# EAGLE schematic finacbv1 (EAGLE 9.1.0)
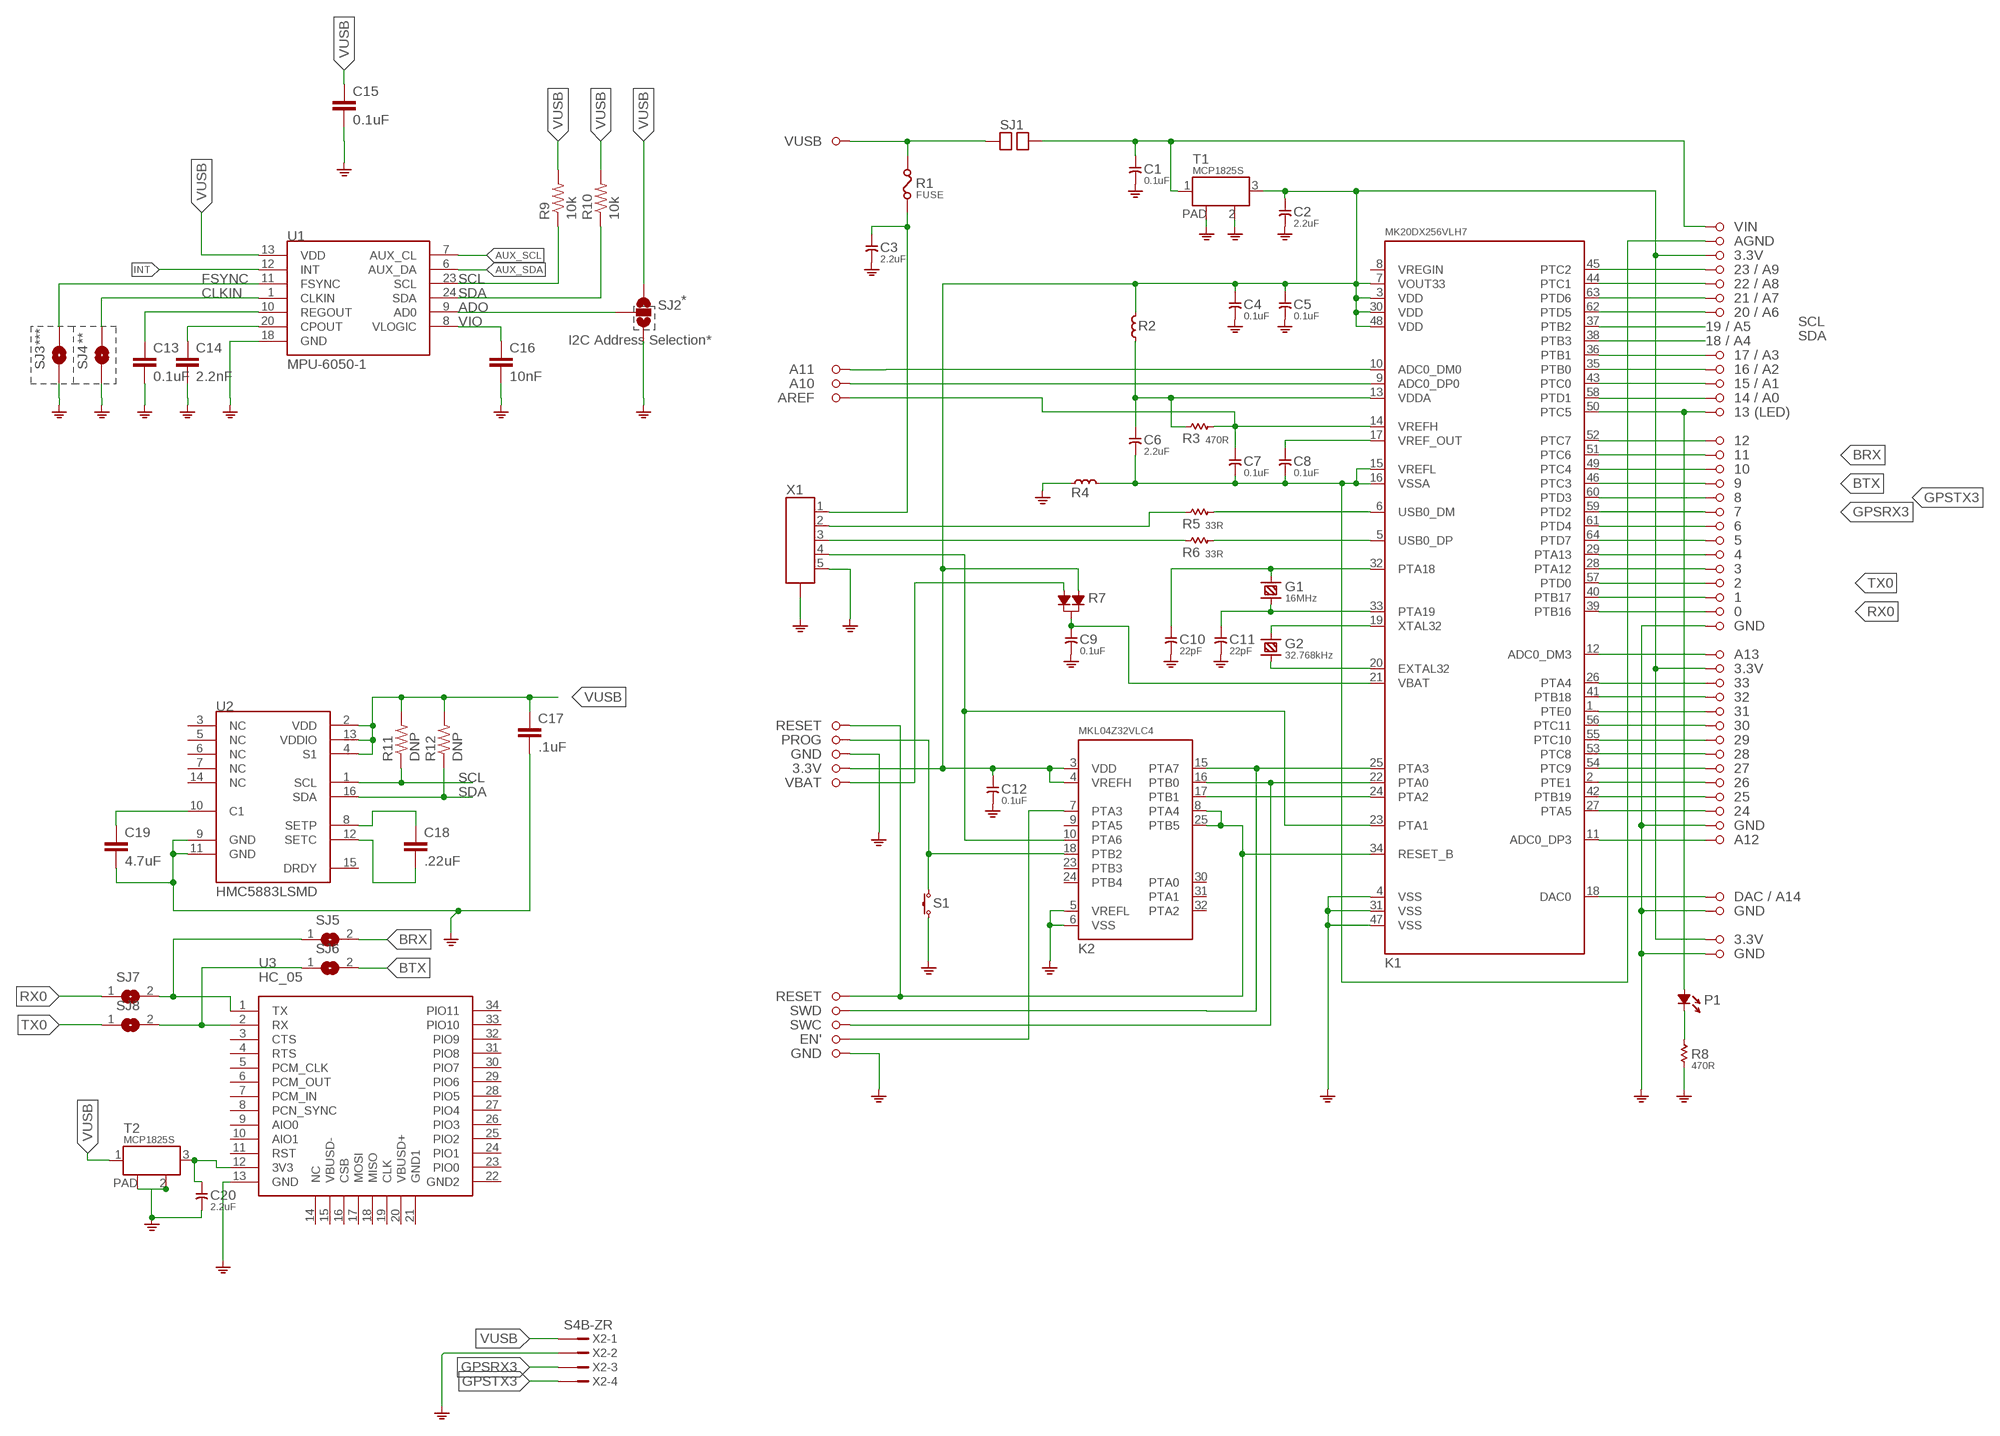
[diagram p0: schematic, sheet 1]

## Parts
C1  0.1uF  CAPACITOR-0.1UF  [C0603]
C2  2.2uF  CAPACITOR-2.2UF  [C0805]
C3  2.2uF  CAPACITOR-2.2UF  [C0805]
C4  0.1uF  CAPACITOR-0.1UF  [C0603]
C5  0.1uF  CAPACITOR-0.1UF  [C0603]
C6  2.2uF  CAPACITOR-2.2UF  [C0805]
C7  0.1uF  CAPACITOR-0.1UF  [C0603]
C8  0.1uF  CAPACITOR-0.1UF  [C0603]
C9  0.1uF  CAPACITOR-0.1UF  [C0603]
C10  22pF  CAPACITOR-22PF  [C0603]
C11  22pF  CAPACITOR-22PF  [C0603]
C12  0.1uF  CAPACITOR-0.1UF  [C0603]
C13  0.1uF  CAP0603-CAP  [0603-CAP]
C14  2.2nF  CAP0603-CAP  [0603-CAP]
C15  0.1uF  CAP0603-CAP  [0603-CAP]
C16  10nF  CAP0603-CAP  [0603-CAP]
C17  .1uF  CAP0402-CAP  [0402-CAP]
C18  .22uF  CAP0402-CAP  [0402-CAP]
C19  4.7uF  CAP0402-CAP  [0402-CAP]
C20  2.2uF  CAPACITOR-2.2UF  [C0805]
G1  16MHz  CRYSTAL-HC49US  [HC49US]
G2  32.768kHz  CRYSTAL-TC26H  [TC26H]
K1  MK20DX256VLH7  [LQFP64-05]
K2  MKL04Z32VLC4  [LQFP32-08]
P1  LED  [LED-0805]
R1  FUSE  [F0805]
R2  FERRITE  [L0603]
R3  470R  RESISTOR-470R  [R0603]
R4  FERRITE  [L0603]
R5  33R  RESISTOR-33R  [R0603]
R6  33R  RESISTOR-33R  [R0603]
R7  DIODE_DUAL  [SOT-23]
R8  470R  RESISTOR-470R  [R0603]
R9  10k  RESISTOR0603-RES  [0603-RES]
R10  10k  RESISTOR0603-RES  [0603-RES]
R11  DNP  RESISTOR0402-RES  [0402-RES]
R12  DNP  RESISTOR0402-RES  [0402-RES]
S1  TACT_SWITCH  [ALPS_SKHH]
SJ1  SOLDERJUMPER  [SOLDERJUMPER]
SJ2  SOLDERJUMPER_2WAYPASTE2&3  [SJ_3_PASTE2&3]
SJ3  SOLDERJUMPERTRACE  [SJ_2S-TRACE]
SJ4  SOLDERJUMPERTRACE  [SJ_2S-TRACE]
SJ5  SJ  [SJ]
SJ6  SJ  [SJ]
SJ7  SJ  [SJ]
SJ8  SJ  [SJ]
SX1  PIN  [PTH_39MIL]
SX2  PIN  [PTH_39MIL]
SX3  PIN  [PTH_39MIL]
SX4  PIN  [PTH_39MIL]
SX5  PIN  [PTH_39MIL]
SX6  PIN  [PTH_39MIL]
SX7  PIN  [PTH_39MIL]
SX8  PIN  [PTH_39MIL]
SX11  PIN  [PTH_39MIL]
SX12  PIN  [PTH_39MIL]
SX13  PIN  [PTH_39MIL]
SX14  PIN  [PTH_39MIL]
SX15  PIN  [PTH_39MIL]
SX16  PIN  [PTH_39MIL]
SX17  PIN  [PTH_39MIL]
SX18  PIN  [PTH_39MIL]
SX19  PIN  [PTH_39MIL]
SX20  PIN  [PTH_39MIL]
SX21  PIN  [PTH_39MIL]
SX22  PIN  [PTH_39MIL]
SX23  PIN  [PTH_39MIL]
SX24  PIN  [PTH_39MIL]
SX25  PIN  [PTH_39MIL]
SX26  PIN  [PTH_39MIL]
SX27  PIN  [PTH_39MIL]
SX28  PIN  [PTH_39MIL]
SX29  PIN  [PTH_39MIL]
SX30  PIN  [PTH_39MIL]
SX31  PIN  [PTH_39MIL]
SX32  PIN  [PTH_39MIL]
SX33  PIN  [PTH_39MIL]
SX34  PIN  [PTH_39MIL]
SX35  PIN  [PTH_39MIL]
SX36  PIN  [PTH_39MIL]
SX37  PIN  [PTH_39MIL]
SX38  PIN  [PTH_39MIL]
SX39  PIN  [PTH_39MIL]
SX40  PIN  [PTH_39MIL]
SX41  PIN  [PTH_39MIL]
SX42  PIN  [PTH_39MIL]
SX43  PIN  [PTH_39MIL]
SX44  PIN  [PTH_39MIL]
SX45  PIN  [PTH_39MIL]
SX46  PIN  [PTH_39MIL]
SX47  PIN  [PTH_39MIL]
SX48  PIN  [PTH_39MIL]
SX49  PIN  [PTH_39MIL]
SX50  PIN  [PTH_39MIL]
SX51  PIN  [PTH_39MIL]
SX52  PIN  [PTH_39MIL]
SX53  PIN  [PTH_39MIL]
SX54  PIN  [PTH_39MIL]
SX55  PIN  [PTH_39MIL]
SX56  PIN  [PTH_39MIL]
SX57  PIN  [PTH_39MIL]
SX58  PIN  [PTH_39MIL]
SX59  PIN  [PTH_39MIL]
SX60  PIN  [PTH_39MIL]
T1  MCP1825S  LDO  [SOT-223]
T2  MCP1825S  LDO  [SOT-223]
U1  MPU-6050-1  [QFN-24-4MM2]
U2  HMC5883LSMD  [16LPCC]
U3  HC_05  [BLUETOOTH_SMD]
X1  MINI-USB  MINI-USBMOLEX_0675031230  [MOLEX_SD-67503-010]
X2  S4B-ZR  [S4B-ZR]

## Nets
ADO: SJ2.2 U1.9(AD0)
AUX_SCL: U1.7(AUX_CL)
AUX_SDA: U1.6(AUX_DA)
BRX: K1.49(PTC4) SJ5.2 SX21.1
BTX: K1.46(PTC3) SJ6.2 SX22.1
CLKIN: SJ4.2 U1.1(CLKIN)
FSYNC: SJ3.2 U1.11(FSYNC)
GND: C1.2 C2.2 C3.2 C4.2 C5.2 C9.2 C10.2 C11.2 C12.2 C13.2 C14.2 C15.2 C16.2 C17.2 C19.2 C20.2 K1.4(VSS) K1.31(VSS) K1.47(VSS) K2.5(VREFL) K2.6(VSS) R4.1 R8.1 S1.3 S1.4 SJ2.3 SJ3.1 SJ4.1 SX32.1 SX42.1 SX50.1 SX53.1 SX55.1 SX60.1 T1.2(GND) T1.PAD T2.2(GND) T2.PAD U1.18(GND) U2.9(GND) U2.11(GND) U3.13(GND) X1.5 X1.P$1(CASE) X1.P$2(CASE) X1.P$3(CASE) X1.P$4(CASE) X1.P$5(CASE) X1.P$6(CASE) X2.2
GPSRX3: K1.59(PTD2) SX24.1 X2.3
GPSTX3: K1.60(PTD3) SX23.1 X2.4
INT: U1.12(INT)
N$1: K2.7(PTA3) SX59.1
N$2: K1.22(PTA0) K2.16(PTB0) SX58.1
N$3: K1.24(PTA2) K2.17(PTB1)
N$4: C14.1 U1.20(CPOUT)
N$5: C10.1 G1.1 K1.32(PTA18)
N$6: C11.1 G1.2 K1.33(PTA19)
N$7: G2.2 K1.19(XTAL32)
N$8: G2.1 K1.20(EXTAL32)
N$9: K2.18(PTB2) S1.1 S1.2 SX40.1
N$10: K1.5(USB0_DP) R6.2
N$11: C8.1 K1.17(VREF_OUT)
N$12: K1.34(RESET_B) K2.8(PTA4) K2.25(PTB5) SX38.1 SX56.1
N$13: C7.1 K1.14(VREFH) R3.2 SX16.1
N$14: K1.6(USB0_DM) R5.2
N$15: C6.1 K1.13(VDDA) R2.1 R3.1
N$16: R6.1 X1.3
N$17: R5.1 X1.2
N$18: C3.1 R1.1 X1.1
N$19: K1.23(PTA1) K2.10(PTA6) X1.4
N$20: C13.1 U1.10(REGOUT)
N$21: K1.45(PTC2) SX5.1
N$22: K1.44(PTC1) SX6.1
N$23: K1.63(PTD6) SX7.1
N$24: K1.62(PTD5) SX8.1
N$25: C18.1 U2.8(SETP)
N$26: C18.2 U2.12(SETC)
N$27: K1.36(PTB1) SX11.1
N$28: K1.35(PTB0) SX13.1
N$29: K1.43(PTC0) SX15.1
N$30: K1.58(PTD1) SX17.1
N$31: K1.50(PTC5) P1.+ SX18.1
N$32: K1.52(PTC7) SX19.1
N$33: K1.51(PTC6) SX20.1
N$34: C20.1 T2.3(OUT) U3.12(3V3)
N$35: SJ5.1 SJ7.2 U3.1(TX)
N$38: K1.61(PTD4) SX25.1
N$39: K1.64(PTD7) SX26.1
N$40: K1.29(PTA13) SX27.1
N$41: K1.28(PTA12) SX28.1
N$42: K1.57(PTD0) SX29.1
N$43: SJ6.1 SJ8.2 U3.2(RX)
N$45: K1.12(ADC0_DM3) SX33.1
N$46: K1.26(PTA4) SX35.1
N$47: K1.41(PTB18) SX36.1
N$48: K1.1(PTE0) SX37.1
N$49: K1.56(PTC11) SX39.1
N$50: K1.55(PTC10) SX41.1
N$51: K1.53(PTC8) SX43.1
N$52: P1.- R8.2
N$53: C6.2 C7.2 C8.2 K1.15(VREFL) K1.16(VSSA) R4.2 SX3.1
N$54: K1.18(DAC0) SX52.1
N$55: K1.11(ADC0_DP3) SX51.1
N$56: C19.1 U2.10(C1)
N$57: K1.27(PTA5) SX49.1
N$58: K1.42(PTB19) SX48.1
N$59: K1.2(PTE1) SX47.1
N$60: K1.54(PTC9) SX45.1
N$61: C1.1 SJ1.2 SX2.1 T1.1(IN)
N$63: R7.2 SX46.1
N$64: K1.10(ADC0_DM0) SX12.1
N$65: K1.9(ADC0_DP0) SX14.1
N$67: R1.2 SJ1.1 SX1.1
N$68: C9.1 K1.21(VBAT) R7.3
N$69: C2.1 C4.1 C5.1 C12.1 K1.3(VDD) K1.7(VOUT33) K1.30(VDD) K1.48(VDD) K2.3(VDD) K2.4(VREFH) R2.2 R7.1 SX4.1 SX34.1 SX44.1 SX54.1 T1.3(OUT)
N$70: K1.25(PTA3) K2.15(PTA7) SX57.1
RX0: K1.39(PTB16) SJ7.1 SX31.1
SCL: K1.37(PTB2) R9.1 R11.1 U1.23(SCL) U2.1(SCL)
SDA: K1.38(PTB3) R10.1 R12.1 U1.24(SDA) U2.16(SDA)
TX0: K1.40(PTB17) SJ8.1 SX30.1
VIO: C16.1 U1.8(VLOGIC)
VUSB: C15.1 C17.1 R9.2 R10.2 R11.2 R12.2 SJ2.1 T2.1(IN) U1.13(VDD) U2.2(VDD) U2.4(S1) U2.13(VDDIO) X2.1
Unconnected: K1.8(VREGIN) K2.9(PTA5) K2.23(PTB3) K2.24(PTB4) K2.30(PTA0) K2.31(PTA1) K2.32(PTA2) U2.3(NC) U2.5(NC) U2.6(NC) U2.7(NC) U2.14(NC) U2.15(DRDY) U3.3(CTS) U3.4(RTS) U3.5(PCM_CLK) U3.6(PCM_OUT) U3.7(PCM_IN) U3.8(PCN_SYNC) U3.9(AIO0) U3.10(AIO1) U3.11(RST) U3.14(NC) U3.15(VBUSD-) U3.16(CSB) U3.17(MOSI) U3.18(MISO) U3.19(CLK) U3.20(VBUSD+) U3.21(GND1) U3.22(GND2) U3.23(PIO0) U3.24(PIO1) U3.25(PIO2) U3.26(PIO3) U3.27(PIO4) U3.28(PIO5) U3.29(PIO6) U3.30(PIO7) U3.31(PIO8) U3.32(PIO9) U3.33(PIO10) U3.34(PIO11)

## Notes on the sheet
- VUSB
- VIN
- AGND
- 3.3V
- 23 / A9
- 22 / A8
- * | 21 / A7
- 20 / A6
- 19 / A5
- ** | 18 / A4
- *** | I2C Address Selection*
- 17 / A3
- A11 | 16 / A2
- A10 | 15 / A1
- AREF | 14 / A0
- 13 (LED)
- 12
- 11
- 10
- 9
- 8
- 7
- 6
- 5
- 4
- 3
- 2
- 1
- 0
- GND
- A13
- 3.3V
- 33
- 32
- 31
- RESET | 30
- PROG | 29
- GND | 28
- 3.3V | 27
- VBAT | 26
- 25
- 24
- GND
- A12
- DAC / A14
- GND
- 3.3V
- GND
- RESET
- SWD
- SWC
- EN'
- GND

## Library data of the parts
C1 C4 C5 C7-C9 C12 = t32_ref:CAPACITOR-0.1UF; DESC: 0.1uF / 16VDC / X7R; MF: Murata Electronics; MPN: GRM188R71C104KA01D; OC_MOUSER: 81-GRM39X104K16; PACKAGE: 0603; TYPE: Capacitor
C2 C3 C6 C20 = t32_ref:CAPACITOR-2.2UF; DESC: 2.2uF / 25 VDC / X7R; MF: Taiyo Yuden; MPN: TMK212B7225KG-TR; OC_MOUSER: 963-TMK212B7225KG-TR; PACKAGE: 0805; TYPE: Capacitor
C10 C11 = t32_ref:CAPACITOR-22PF; DESC: 22pF / 50VDC / C0G (NP0); MF: Vishay / Vitramon; MPN: VJ0603A220JXACW1BC; OC_MOUSER: 77-VJ0603A220JXACBC; PACKAGE: 0603; TYPE: Capacitor
C13-C19 = SparkFun:CAP: Capacitor Standard 0603 ceramic capacitor, and 0.1" leaded capacitor.
G1 = t32_ref:CRYSTAL-; DESC: 16MHz / 18pF / 10ppm; MF: ABRACON; MPN: ABL-16.000MHz-B1U; OC_MOUSER: 815-ABL-16-B1U; PACKAGE: HC-49US; TYPE: Crystal
G2 = t32_ref:CRYSTAL-; DESC: 32.768kHz / 12.5pF / 20ppm; MF: Citizen FineDevice; MPN: CFS206-32.768KDZF-UB; OC_MOUSER: 695-CFS206-327KF-U; PACKAGE: TC-26H; TYPE: Crystal
K1 = t32_ref:MK20DX256VLH7; DESC: MK20DX256VLH7; MF: NXP; MPN: MK20DX256VLH7; OC_MOUSER: 841-MK20DX256VLH7; PACKAGE: LQFP-64; TYPE: Microcontroller
K2 = t32_ref:MKL04Z32VLC4; DESC: MKL04Z32VLC4 (preprogrammed); MF: PJRC; MPN: IC_MKL04Z32_TQFP32; PACKAGE: LQFP-32; TYPE: Microcontroller
P1 = t32_ref:LED; DESC: orange; MF: ROHM Semiconductor; MPN: SML-211DTT86; OC_MOUSER: 755-SML-211DTT86; PACKAGE: 0805; TYPE: LED
R1 = t32_ref:FUSE; DESC: 6V / 0.5A; MF: Bel Fuse; MPN: 0ZCK0050FF2E; OC_MOUSER: 530-0ZCK0050FF2E; PACKAGE: 0805; TYPE: PPTC
R2 R4 = t32_ref:FERRITE; DESC: 600R / 100MHz; MF: Murata Electronics; MPN: BLM18AG601SN1D; OC_MOUSER: 81-BLM11A601S; PACKAGE: 0603; TYPE: Ferrite
R3 R8 = t32_ref:RESISTOR-470R; DESC: 470R / 1 % / 0.1 W; MF: Vishay; MPN: CRCW0603470RFKEA; OC_MOUSER: 71-CRCW0603-470-E3; PACKAGE: 0603; TYPE: Resistor
R5 R6 = t32_ref:RESISTOR-33R; DESC: 33R / 1% / 0.25 W; MF: Panasonic; MPN: ERJ-PA3F33R0V; OC_MOUSER: 667-ERJ-PA3F33R0V; PACKAGE: 0603; TYPE: Resistor
R7 = t32_ref:DIODE_DUAL; DESC: Dual Schottky, common cat; MF: NXP Semiconductors; MPN: BAT54C,215; OC_MOUSER: 771-BAT54C-T/R; PACKAGE: SOT-23; TYPE: Diode
R9-R12 = SparkFun:RESISTOR: Resistor Basic schematic elements and footprints for 0603, 1206, and PTH resistors.
S1 = t32_ref:TACT_SWITCH; DESC: SPST; MF: ALPS; MPN: SKHHPKA010; OC_MOUSER: 688-SKHHPK; PACKAGE: 6x6x5 MM; TYPE: Tactile switch
SJ1 = t32_ref:SOLDERJUMPER
SJ2 = SparkFun:SOLDERJUMPER_2WAY: Solder Jumper 2 way solder jumper
SJ3 SJ4 = SparkFun:SOLDERJUMPER: Solder Jumper Standard SMD solder jumper. Used to automate production. Two varients : Normally Open and Normally Closed are the same, but have different paste layers. NC will have a large amount of paste and should jumper during reflow.
SJ5-SJ8 = jumper:SJ: SMD solder JUMPER
SX1-SX8 SX11-SX60 = t32_ref:PIN
T1 T2 = t32_ref:LDO; DESC: 3.3V 500mA; MF: Microchip Technology; MPN: MCP1825S-3302E/DB; OC_MOUSER: 579-MCP1825S-3302EDB; PACKAGE: SOT-223-3; TYPE: Voltage regulator
U1 = Testing:MPU-6050
U2 = SparkFun:HMC5883L: 3 Axis Digital Compass IC
U3 = buetooth:HC_05: HC-05 Bluetooth Module
X1 = t32_ref:MINI-USB; DESC: MINI USB; MF: MOLEX; MPN: 0675031020; OC_MOUSER: 538-67503-1020; TYPE: Mini USB
X2 = con-jst:?4B-ZR: ZH CONNECTOR 1.5 mm, 4 pin 1 row Source: http://www.jst.com .. eZH.pdf; MF: FARNELL; MPN: S4B-ZR(LF)(SN); OC_FARNELL: 9491830; OC_NEWARK: 38K8076